# EAGLE schematic PIRBOARD (EAGLE 7.5.0)
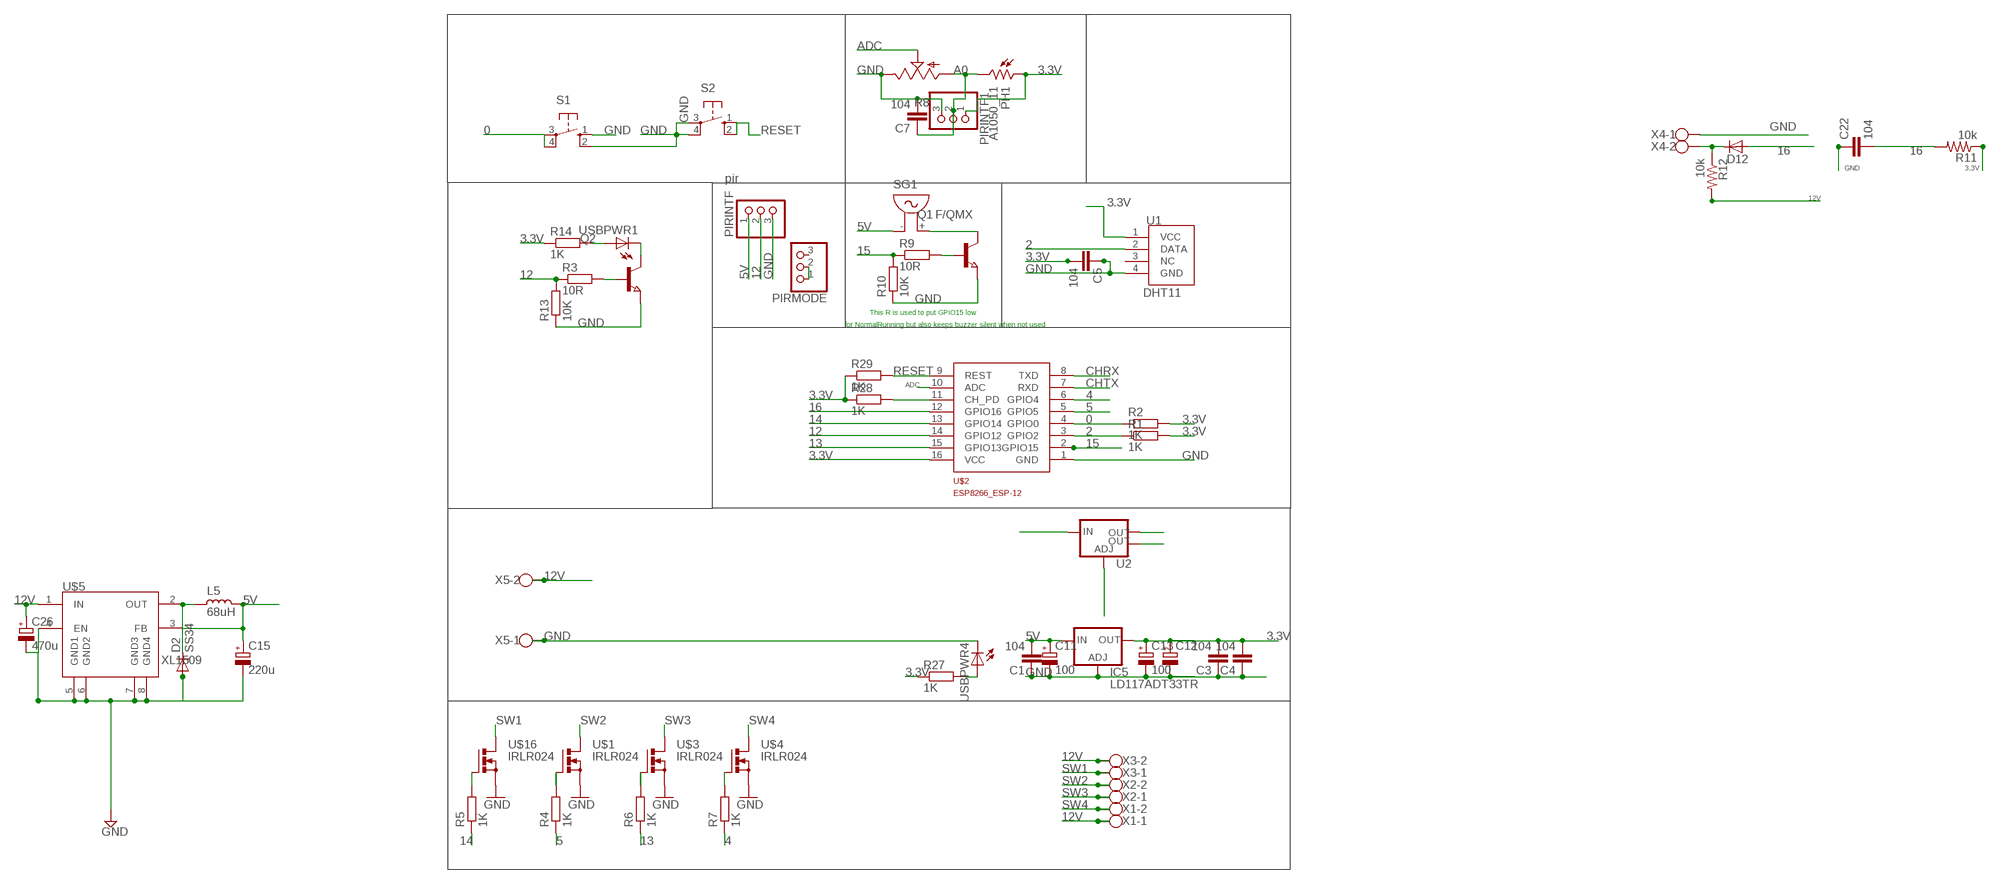
[diagram p0: schematic, sheet 1]

## Parts
C1  104  C-EUC1206  [C1206]
C3  104  C-EUC1206  [C1206]
C4  104  C-EUC1206  [C1206]
C5  104  C-EUC1206  [C1206]
C7  104  C-EUC1206  [C1206]
C11  100  CPOL-EUC  [PANASONIC_C]
C12  CPOL-EUE2.5-7  [E2,5-7]
C13  100  CPOL-EUC  [PANASONIC_C]
C15  220u  CPOL-EUE2.5-7  [E2,5-7]
C22  104  C-EUC1206  [C1206]
C26  470u  CPOL-EUE2.5-7  [E2,5-7]
D2  SS34  DIODE-DO-214AC  [DO-214AC]
D12  D-SOD-80  [SOD80]
IC5  LD117ADT33TR  [DPACK]
L5  68uH  L_CD75  [CD75]
PH1  A1050_11  [T0-46-A10XX]
PIRINTF  PINHD-1X3  [1X03]
PIRINTF1  PINHD-1X3  [1X03]
PIRMODE  PINHD-1X3  [1X03]
Q1  NPN-TRANSISTOR_SOT23W  [SOT23W]
Q2  NPN-TRANSISTOR_SOT23W  [SOT23W]
R1  1K  R-EU_M1206  [M1206]
R2  1K  R-EU_M1206  [M1206]
R3  10R  R-EU_M1206  [M1206]
R4  1K  R-EU_M1206  [M1206]
R5  1K  R-EU_M1206  [M1206]
R6  1K  R-EU_M1206  [M1206]
R7  1K  R-EU_M1206  [M1206]
R8  TRIM_US-RJ9W  [RJ9W]
R9  10R  R-EU_M1206  [M1206]
R10  10K  R-EU_M1206  [M1206]
R11  10k  R-US_R1206  [R1206]
R12  10k  R-US_R1206  [R1206]
R13  10K  R-EU_M1206  [M1206]
R14  1K  R-EU_M1206  [M1206]
R27  1K  R-EU_M1206  [M1206]
R28  1K  R-EU_M1206  [M1206]
R29  1K  R-EU_M1206  [M1206]
S1  10-XX  [B3F-10XX]
S2  10-XX  [B3F-10XX]
SG1  F/QMX  [F/QMX]
U1  DHT11  [DHT11]
U2  V_REG_LM1117SOT223  [SOT223]
U$1  IRLR024  N-POWER-MOSFETDPAK-MOSFET  [D-PAK_TO252AA]
U$2  ESP8266_ESP-12  [ESP8266-ESP12]
U$3  IRLR024  N-POWER-MOSFETDPAK-MOSFET  [D-PAK_TO252AA]
U$4  IRLR024  N-POWER-MOSFETDPAK-MOSFET  [D-PAK_TO252AA]
U$5  XL1509  [SO08]
U$16  IRLR024  N-POWER-MOSFETDPAK-MOSFET  [D-PAK_TO252AA]
USBPWR1  LEDCHIPLED_1206  [CHIPLED_1206]
USBPWR4  LEDCHIPLED_1206  [CHIPLED_1206]
X1  W237-102  [W237-102]
X2  W237-102  [W237-102]
X3  W237-102  [W237-102]
X4  W237-102  [W237-102]
X5  W237-102  [W237-102]

## Nets
0: R2.1 S1.3(P) S1.4(P1) U$2.4(GPIO0)
2: R1.1 U1.2(DATA) U$2.3(GPIO2)
3.3V: C3.2 C4.2 C5.2 C12.+ C13.+ IC5.4(OUT) PH1.1 PIRINTF1.1 R1.2 R2.2 R11.1 R14.1 R27.1 R28.1 R29.1 U1.1(VCC) U2.2(OUT) U2.4(OUT) U$2.16(VCC)
4: R7.1 U$2.6(GPIO4)
5: R4.1 U$2.5(GPIO5)
5V: C1.2 C11.+ C15.+ IC5.3(IN) L5.1 PIRINTF.1 SG1.- U2.3(IN) U$5.3(FB)
12: PIRINTF.2 R3.1 R13.2 U$2.14(GPIO12)
12V: C26.+ R12.2 U$5.1(IN) X1.1 X3.2 X5.2
13: R6.1 U$2.15(GPIO13)
14: R5.1 U$2.13(GPIO14)
15: R9.1 R10.2 U$2.2(GPIO15)
16: C22.2 D12.2(A) R11.2 U$2.12(GPIO16)
A0: C7.1 PH1.2 PIRINTF1.2 R8.A
ADC: R8.S U$2.10(ADC)
CHRX: U$2.8(TXD)
CHTX: U$2.7(RXD)
GND: C1.1 C3.1 C4.1 C5.1 C7.2 C11.- C12.- C13.- C15.- C22.1 C26.- D2.2(A) IC5.1(ADJ) PIRINTF1.3 PIRINTF.3 Q1.3(E) Q2.3(E) R8.E R10.1 R13.1 S1.1(S) S1.2(S1) S2.3(P) S2.4(P1) U1.4(GND) U2.1(ADJ) U$1.3(S) U$2.1(GND) U$3.3(S) U$4.3(S) U$5.4(EN) U$5.5(GND1) U$5.6(GND2) U$5.7(GND3) U$5.8(GND4) U$16.3(S) USBPWR4.C X4.1 X5.1
MAG: D12.1(C) R12.1 X4.2
N$3: R14.2 USBPWR1.A
N$4: D2.1(C) L5.2 U$5.2(OUT)
N$6: Q2.1(B) R3.2
N$8: Q2.2(C) USBPWR1.C
N$10: R27.2 USBPWR4.A
N$11: PIRMODE.1 PIRMODE.2
N$15: R4.2 U$1.1(G)
N$17: R5.2 U$16.1(G)
N$18: R28.2 U$2.11(CH_PD)
N$20: R6.2 U$3.1(G)
N$22: R7.2 U$4.1(G)
N$23: Q1.1(B) R9.2
N$24: Q1.2(C) SG1.+
RESET: R29.2 S2.1(S) S2.2(S1) U$2.9(REST)
SW1: U$16.4(D) X3.1
SW2: U$1.4(D) X2.2
SW3: U$3.4(D) X2.1
SW4: U$4.4(D) X1.2
Unconnected: PIRMODE.3 U1.3(NC)

## Notes on the sheet
- pir
- This R is used to put GPIO15 low
- for NormalRunning but also keeps buzzer silent when not used

## Library data of the parts
C1 C3-C5 C7 C22 = rcl:C-EU: CAPACITOR, European symbol
C11 C13 C15 C26 = rcl:CPOL-EU: POLARIZED CAPACITOR, European symbol
C12 = resistor:CPOL-EU: POLARIZED CAPACITOR, European symbol
D2 = dp_devices:DIODE: Various Diode Packages
D12 = semicon-smd-ipc:D-: DIODE unfilled
IC5 = v-reg:LD117A?*: Low drop fixed and adjustable positive voltage regulators 1 A Source: http://www.st.com/stonline/products/literature/ds/7194/ld1117axx.pdf
L5 = rc-master-smd:L_: INDUCTOR
PH1 = photo-elements:A10: Sensor Robust Light Sensing Applications Outdoor Light Sensing Application Source: http://optoelectronics.perkinelmer.com/content/Datasheets/DTS_PhotocellsA1050.pdf
PIRINTF PIRINTF1 PIRMODE = pinhead:PINHD-1X3: PIN HEADER
Q1 Q2 = semicon-smd-ipc:NPN-TRANSISTOR_: NPN TRANSISTOR
R1-R7 R9 R10 R13 R14 R27-R29 = rcl:R-EU_: RESISTOR, European symbol
R8 = pot:TRIM_US-: POTENTIOMETER
R11 R12 = adafruit:R-US_: RESISTOR, American symbol
S1 S2 = switch-omron:10-XX: OMRON SWITCH; MPN: B3F-1000; OC_FARNELL: 176432; OC_NEWARK: 36M3542
SG1 = buzzer:F/QMX: BUZZER Source: Buerklin; OC_FARNELL: unknown; OC_NEWARK: unknown
U1 = Sensors:DHT11
U2 = SparkFun-PowerIC:V_REG_LM1117: Voltage Regulator LM1117 Standard adjustable voltage regulator but in SMD form. Spark Fun Electronics SKU : COM-00595; PROD_ID: VREG-08170
U$1 U$3 U$4 U$16 = Cohesion_parts:N-POWER-MOSFET
U$2 = ESP8266-ESP12:ESP8266_ESP-12: ESP8266 ESP-12 Discussion about pins here: http://www.esp8266.com/viewtopic.php?f=13&t=1429
U$5 = Cohesion_parts:XL1509
USBPWR1 USBPWR4 = RepRapjr:LED: LED OSRAM: - CHIPLED LG R971, LG N971, LY N971, LG Q971, LY Q971, LO R971, LY R971 LH N974, LH R974 LS Q976, LO Q976, LY Q976 LO Q996 - Hyper CHIPLED LW Q18S LB Q993, LB Q99A, LB R99A - SideLED LS A670, LO A670, LY A670, LG A670, LP A670 LB A673, LV A673, LT A673, LW A673 LH A674 LY A675 LS A676, LA A676, LO A676, LY A676, LW A676 LS A679, LY A679, LG A679 - Hyper Micro SIDELED® LS Y876, LA Y876, LO Y876, LY Y876 LT Y87S - SmartLED LW L88C, LW L88S LB L89C, LB L89S, LG L890 LS L89K, LO L89K, LY L89K LS L896, LA L896, LO L896, LY L896 - TOPLED LS T670, LO T670, LY T670, LG T670, LP T670 LSG T670, LSP T670, LSY T670, LOP T670, LYG T670 LG T671, LOG T671, LSG T671 LB T673, LV T673, LT T673, LW T673 LH T674 LS T676, LA T676, LO T676, LY T676, LB T676, LH T676, LSB T676, LW T676 LB T67C, LV T67C, LT T67C, LS T67K, LO T67K, LY T67K, LW E67C LS E67B, LA E67B, LO E67B, LY E67B, LB E67C, LV E67C, LT E67C LW T67C LS T679, LY T679, LG T679 LS T770, LO T770, LY T770, LG T770, LP T770 LB T773, LV T773, LT T773, LW T773 LH T774 LS E675, LA E675, LY E675, LS T675 LS T776, LA T776, LO T776, LY T776, LB T776 LHGB T686 LT T68C, LB T68C - Hyper Mini TOPLED® LB M676 - Mini TOPLED Santana® LG M470 LS M47K, LO M47K, LY M47K Source: http://www.osram.convergy.de LUXEON: - LUMILED® LXK2-PW12-R00, LXK2-PW12-S00, LXK2-PW14-U00, LXK2-PW14-V00 LXK2-PM12-R00, LXK2-PM12-S00, LXK2-PM14-U00 LXK2-PE12-Q00, LXK2-PE12-R00, LXK2-PE12-S00, LXK2-PE14-T00, LXK2-PE14-U00 LXK2-PB12-K00, LXK2-PB12-L00, LXK2-PB12-M00, LXK2-PB14-N00, LXK2-PB14-P00, LXK2-PB14-Q00 LXK2-PR12-L00, LXK2-PR12-M00, LXK2-PR14-Q00, LXK2-PR14-R00 LXK2-PD12-Q00, LXK2-PD12-R00, LXK2-PD12-S00 LXK2-PH12-R00, LXK2-PH12-S00 LXK2-PL12-P00, LXK2-PL12-Q00, LXK2-PL12-R00 Source: www.luxeon.com KINGBRIGHT: KA-3528ASYC Source: www.kingbright.com
X1-X5 = con-wago-500:W237-102: WAGO SCREW CLAMP; MPN: 237-102; OC_FARNELL: unknown; OC_NEWARK: 70K9898

## Net classes
5 3.3-Amp Class: width 1.27 mm